# EAGLE design esp8266_programmer (EAGLE 9.6.2)
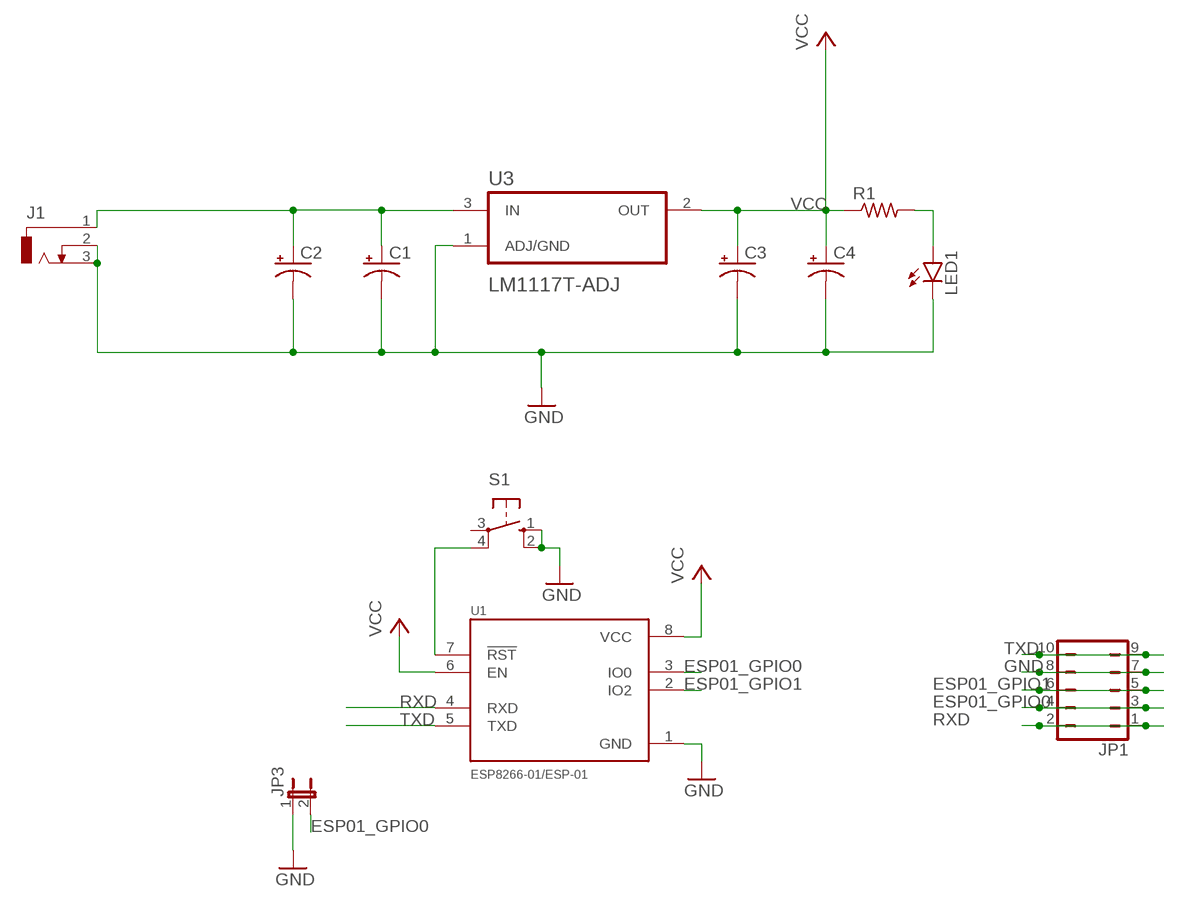
[diagram p0: schematic, sheet 1]

## Parts
C1  CPOL-USE1.8-4  [E1,8-4]
C2  CPOL-USE1.8-4  [E1,8-4]
C3  CPOL-USE1.8-4  [E1,8-4]
C4  CPOL-USE1.8-4  [E1,8-4]
J1  DCJ0303  [DCJ0303]
JP1  JP5Q  [JP5Q]
JP3  JP1E  [JP1]
LED1  LED3MM  [LED3MM]
R1  R-US_0204/7  [0204/7]
S1  10-XX  [B3F-10XX]
U1  ESP8266-01/ESP-01  [XCVR_ESP8266-01/ESP-01]
U3  LM1117T-ADJ  [TO254P1054X470X1955-3]

## Nets
ESP01_GPIO0: JP1.3 JP1.4 JP3.2 U1.3(IO0)
ESP01_GPIO1: JP1.5 JP1.6 U1.2(IO2)
GND: C1.- C2.- C3.- C4.- J1.2 J1.3 JP1.7 JP1.8 JP3.1 LED1.K(C) S1.1(S) S1.2(S1) U1.1(GND) U3.1(ADJ/GND)
N$1: C1.+ C2.+ J1.1 U3.3(IN)
N$3: S1.4(P1) U1.7(!RST)
N$9: LED1.A R1.2
RXD: JP1.1 JP1.2 U1.4(RXD)
TXD: JP1.9 JP1.10 U1.5(TXD)
VCC: C3.+ C4.+ R1.1 U1.6(EN) U1.8(VCC) U3.2(OUT)
Unconnected: S1.3(P)

## Library data of the parts
C1-C4 = rcl:CPOL-US: POLARIZED CAPACITOR, American symbol; SPICEPREFIX: C
J1 = con-jack:DCJ0303: DC POWER JACK Source: DCJ0303.pdf; OC_FARNELL: unknown; OC_NEWARK: unknown
JP1 = jumper:JP5Q: JUMPER
JP3 = jumper:JP1E: JUMPER
LED1 = led:LED: LED OSRAM: - CHIPLED LG R971, LG N971, LY N971, LG Q971, LY Q971, LO R971, LY R971 LH N974, LH R974 LS Q976, LO Q976, LY Q976 LO Q996 - Hyper CHIPLED LW Q18S LB Q993, LB Q99A, LB R99A - SideLED LS A670, LO A670, LY A670, LG A670, LP A670 LB A673, LV A673, LT A673, LW A673 LH A674 LY A675 LS A676, LA A676, LO A676, LY A676, LW A676 LS A679, LY A679, LG A679 - Hyper Micro SIDELED® LS Y876, LA Y876, LO Y876, LY Y876 LT Y87S - SmartLED LW L88C, LW L88S LB L89C, LB L89S, LG L890 LS L89K, LO L89K, LY L89K LS L896, LA L896, LO L896, LY L896 - TOPLED LS T670, LO T670, LY T670, LG T670, LP T670 LSG T670, LSP T670, LSY T670, LOP T670, LYG T670 LG T671, LOG T671, LSG T671 LB T673, LV T673, LT T673, LW T673 LH T674 LS T676, LA T676, LO T676, LY T676, LB T676, LH T676, LSB T676, LW T676 LB T67C, LV T67C, LT T67C, LS T67K, LO T67K, LY T67K, LW E67C LS E67B, LA E67B, LO E67B, LY E67B, LB E67C, LV E67C, LT E67C LW T67C LS T679, LY T679, LG T679 LS T770, LO T770, LY T770, LG T770, LP T770 LB T773, LV T773, LT T773, LW T773 LH T774 LS E675, LA E675, LY E675, LS T675 LS T776, LA T776, LO T776, LY T776, LB T776 LHGB T686 LT T68C, LB T68C - Hyper Mini TOPLED® LB M676 - Mini TOPLED Santana® LG M470 LS M47K, LO M47K, LY M47K Source: http://www.osram.convergy.de LUXEON: - LUMILED® LXK2-PW12-R00, LXK2-PW12-S00, LXK2-PW14-U00, LXK2-PW14-V00 LXK2-PM12-R00, LXK2-PM12-S00, LXK2-PM14-U00 LXK2-PE12-Q00, LXK2-PE12-R00, LXK2-PE12-S00, LXK2-PE14-T00, LXK2-PE14-U00 LXK2-PB12-K00, LXK2-PB12-L00, LXK2-PB12-M00, LXK2-PB14-N00, LXK2-PB14-P00, LXK2-PB14-Q00 LXK2-PR12-L00, LXK2-PR12-M00, LXK2-PR14-Q00, LXK2-PR14-R00 LXK2-PD12-Q00, LXK2-PD12-R00, LXK2-PD12-S00 LXK2-PH12-R00, LXK2-PH12-S00 LXK2-PL12-P00, LXK2-PL12-Q00, LXK2-PL12-R00 Source: www.luxeon.com KINGBRIGHT: KA-3528ASYC Source: www.kingbright.com
R1 = rcl:R-US_: RESISTOR, American symbol; SPICEPREFIX: R
S1 = switch-omron:10-XX: OMRON SWITCH; MPN: B3F-1000; OC_FARNELL: 176432; OC_NEWARK: 36M3542
U1 = ESP8266-01_ESP-01:ESP8266-01/ESP-01: MakerFocus 4pcs ESP8266 ESP-01 Serial Wireless WiFi Transceiver Receiver Module 1MB SPI Flash DC3.0-3.6V Internet of Things WiFi Module Board Compatible with Ar duino Check availability <https://pricing.snapeda.com/parts/ESP8266-01/ESP-01/AI-Thinker/view-part?ref=eda>; AVAILABILITY: Not in stock; CHECK_PRICES: https://www.snapeda.com/parts/ESP8266-01/ESP-01/AI-Thinker/view-part/?ref=eda; DESCRIPTION: MakerFocus 4pcs ESP8266 ESP-01 Serial Wireless WiFi Transceiver Receiver Module 1MB SPI Flash DC3.0-3.6V Internet of Things WiFi Module Board Compatible with Ar duino; MF: AI-Thinker; MP: ESP8266-01/ESP-01; PACKAGE: Non-Standard AI-Thinker; PRICE: None; SNAPEDA_LINK: https://www.snapeda.com/parts/ESP8266-01/ESP-01/AI-Thinker/view-part/?ref=snap
U3 = LM1117T-ADJ:LM1117T-ADJ: Check availability <https://pricing.snapeda.com/parts/LM1117T-ADJ/Texas%20Instruments/view-part?ref=eda>; AVAILABILITY: In Stock; CHECK_PRICES: https://www.snapeda.com/parts/LM1117T-ADJ/Texas+Instruments/view-part/?ref=eda; DESCRIPTION: Linear Voltage Regulator IC Positive Adjustable 1 Output 800mA TO-220-3; MF: Texas Instruments; MP: LM1117T-ADJ; PACKAGE: TO-220-3 TEXAS INSTRUMENTS; PRICE: None; PURCHASE-URL: https://www.snapeda.com/api/url_track_click_mouser/?unipart_id=558049&manufacturer=Texas Instruments&part_name=LM1117T-ADJ&search_term=None; SNAPEDA_LINK: https://www.snapeda.com/parts/LM1117T-ADJ/Texas+Instruments/view-part/?ref=snap

## Board
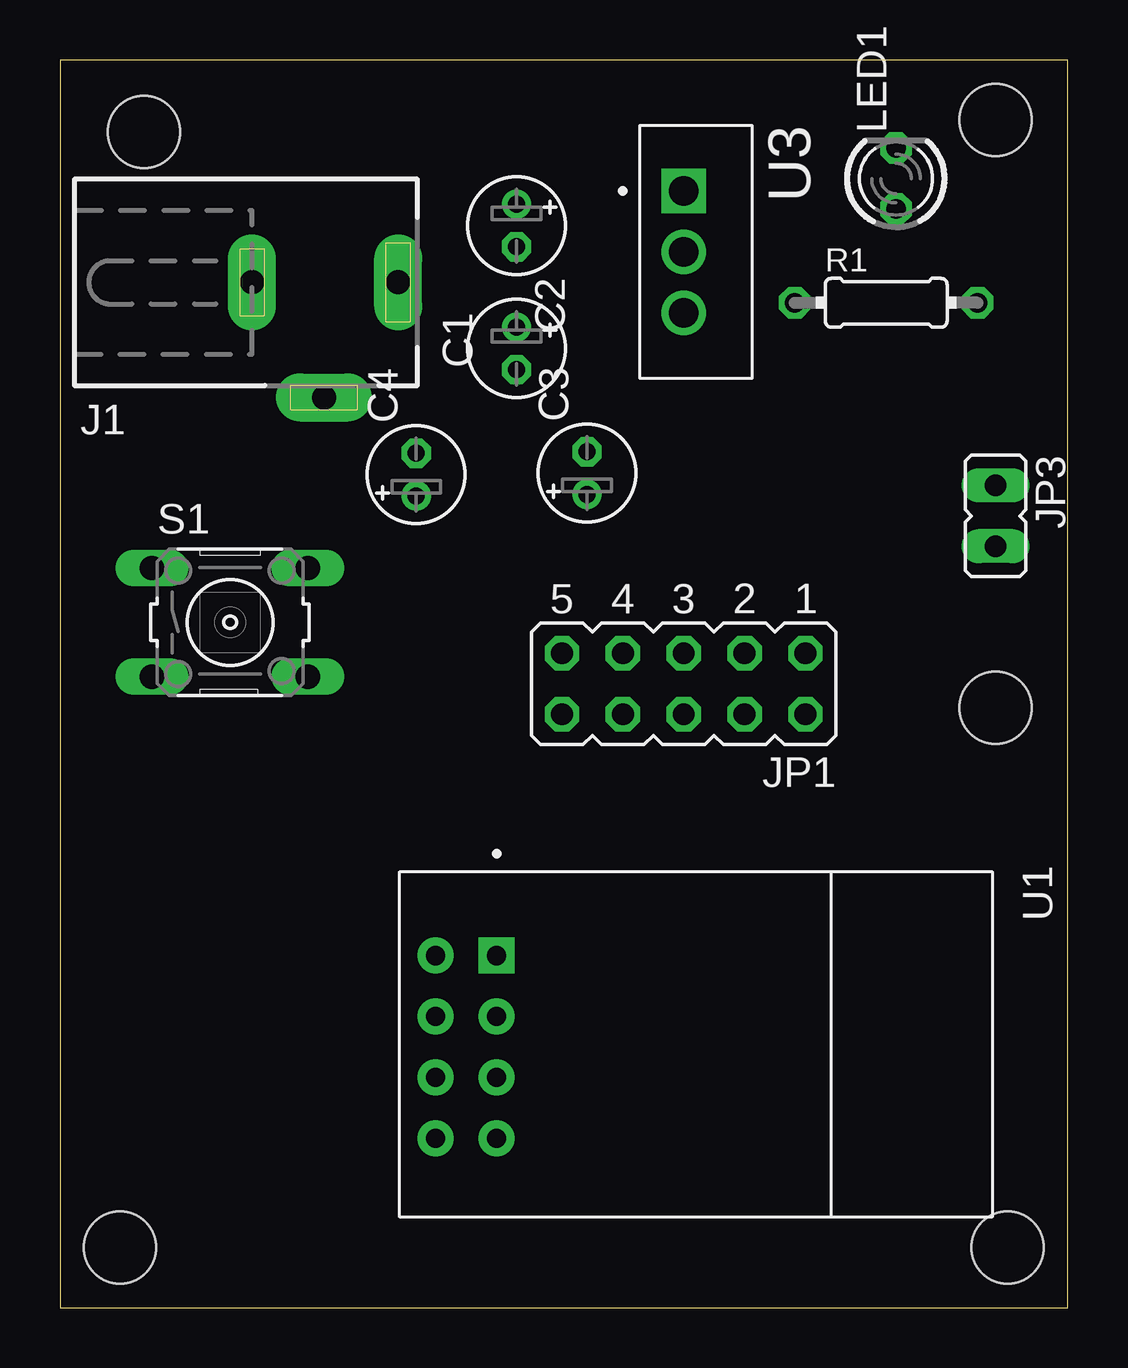
[diagram p1: board, top side]
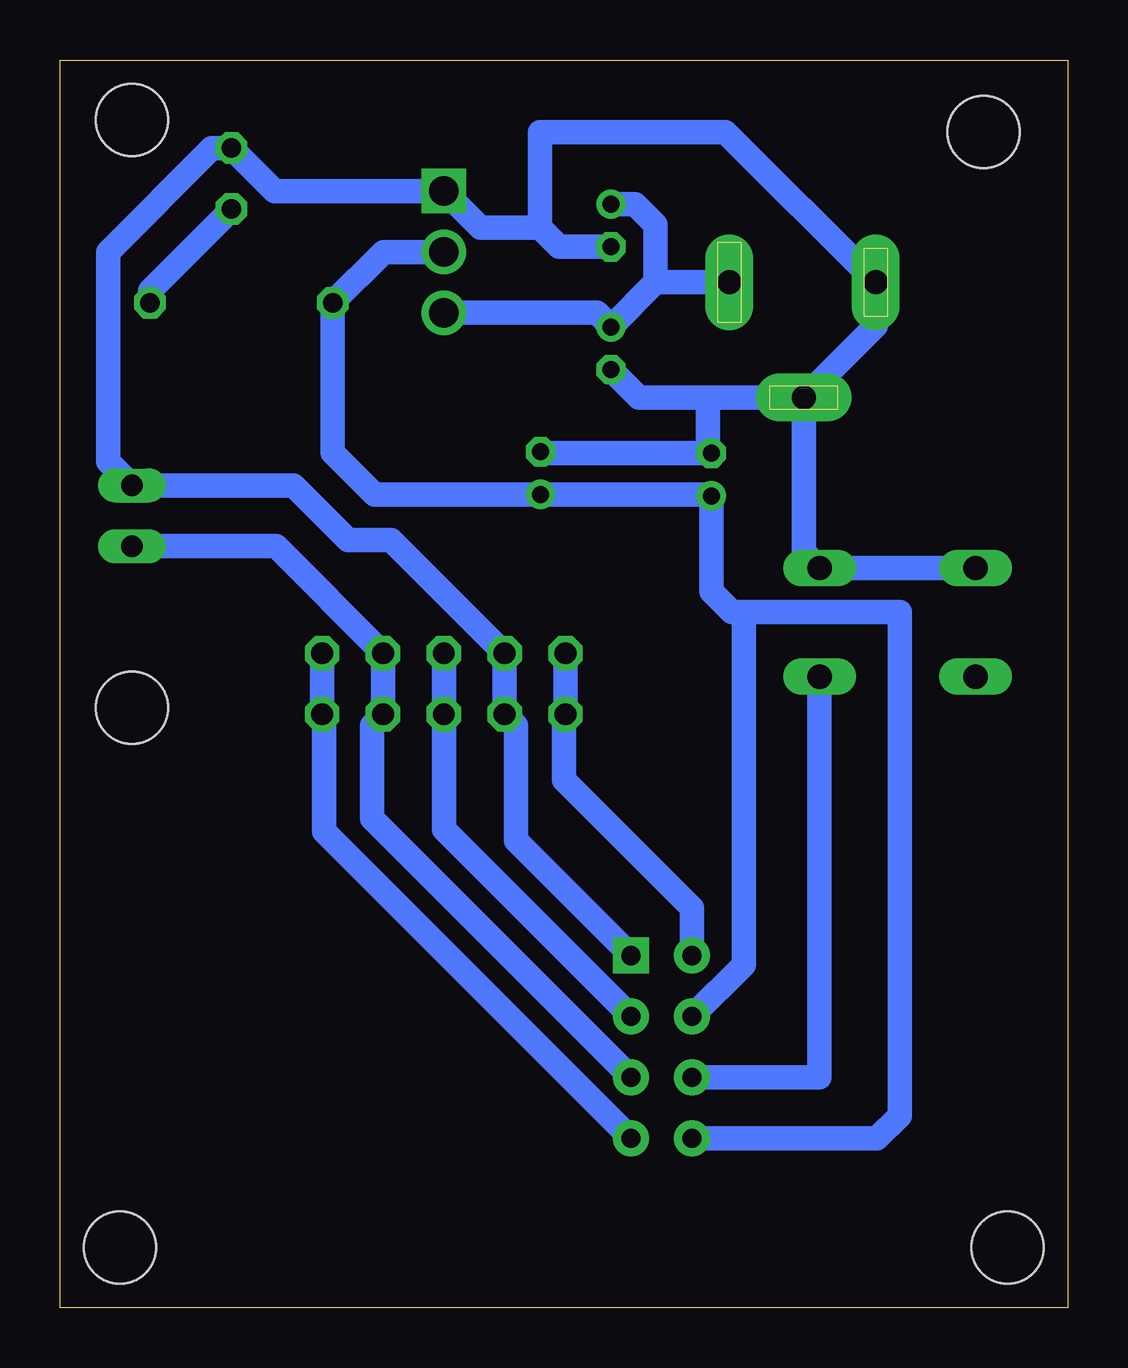
[diagram p2: board, bottom side, seen from below]

Size 42 x 52 mm. Coordinates in mm from the lower left corner, seen from the top.
Outline: 0,0 42,0 42,52 0,52 0,0
Copper layers (1*16): Top 0.035mm / dielectric 1.5mm / Bottom 0.035mm
Design rules "default *": minimum track width 25mil, minimum drill 1mm, track to track 6mil, track to pad 6mil, pad to pad 6mil, via to via 6mil, smd to smd 6mil, copper to edge 40mil, drill to drill 6mil, minimum pad ring 10mil, minimum via ring 8mil, stop-mask expansion 4mil, vias tented up to drill 0mil, thermal gap 10mil
Holes 3 mm at 3.5,49 39,49.5 2.5,2.5 39,25 39.5,2.5

### Footprints (pad centres in the part's own frame; a part is rotated, then mirrored left to right if it is on the bottom)
E1,8-4 = drill 0.711 pad 1.168: + -0.889,0 | drill 0.711 pad 1.168 octagon: - 0.889,0
DCJ0303 = drill 1 pad 2 long: 1 0,3.1; 2 4.8,0; 3 0,-3
JP5Q = drill 0.914 octagon: 1 -5.08,-1.27; 2 -5.08,1.27; 3 -2.54,-1.27; 4 -2.54,1.27; 5 0,-1.27; 6 0,1.27; 7 2.54,-1.27; 8 2.54,1.27; 9 5.08,-1.27; 10 5.08,1.27
JP1 = drill 0.914 long: 1 0,-1.27; 2 0,1.27
LED3MM = drill 0.813 octagon: A -1.27,0; K 1.27,0
0204/7 = drill 0.813 octagon: 1 -3.81,0; 2 3.81,0
B3F-10XX = drill 1.016 long: 1 -3.251,2.261; 2 3.251,2.261; 3 -3.251,-2.261; 4 3.251,-2.261
XCVR_ESP8266-01/ESP-01 = drill 0.8 pad 1.5 square: 1 -3.81,-8.31 | drill 0.8 pad 1.5: 2 -1.27,-8.31; 3 1.27,-8.31; 4 3.81,-8.31; 5 -3.81,-10.85; 6 -1.27,-10.85; 7 1.27,-10.85; 8 3.81,-10.85
TO254P1054X470X1955-3 = drill 1.24 square: 1 -2.54,0 | drill 1.24: 2 0,0; 3 2.54,0

### Placement (x,y rotation side)
C1  19.03,39.98 270 top
C2  19.03,45.1 270 top
C3  21.97,34.78 90 top
C4  14.85,34.72 90 top
J1  11,42.73 270 top
JP1  26,26 180 top
JP3  39,33 180 top
LED1  34.85,47.06 90 top
R1  34.44,41.88 0 top
S1  7.09,28.56 0 top
U1  26.51,10.86 270 top
U3  26,44 270 top

### Tracks (layer width: path | path; a pad name or v marks a point on that pad's centre or on a via)
ESP01_GPIO0
  Bottom 1.016: U1.3 29,20.39 29,24.27 JP1.4 JP1.3 33,31.73 JP3.2
ESP01_GPIO1
  Bottom 1.016: U1.2 26,19.93 JP1.6 JP1.5
GND
  Bottom 1.016: U1.1 23,19.47 23,24.27 JP1.8 JP1.7 28.19,32 30,32 32.27,34.27 JP3.1 40,35.27 40,44 35.67,48.33 LED1.K 33.06,46.54 U3.1 24.48,45.02 22,45.02 | J1.2 8,40.93 J1.3 14.27,49 22,49 22,45.02 | J1.2 11,31.48 10.52,31 | 10.52,31 S1.2 | S1.1 S1.2 | S1.2 10.52,31 | C1.- 17.87,37.93 15,37.93 | J1.2 15,37.93 | C3.- 21.91,35.61 C4.- 15,35.76 15,37.93 | C2.- 21.19,44.21 22,45.02
N$1
  Bottom 1.016: J1.1 17.17,42.73 | 17.17,42.73 C1.+ 19.62,41.46 U3.3 | C2.+ 18.03,45.99 17.17,45.13 17.17,42.73
N$3
  Bottom 1.016: U1.7 10.34,9.59 S1.4
N$9
  Bottom 1.016: LED1.A 38.25,42.39 R1.2
RXD
  Bottom 1.016: U1.4 31,19.85 31,24.65 JP1.2 JP1.1
TXD
  Bottom 1.016: U1.5 15.66,16.66 21,22 21,24.65 JP1.10 JP1.9
VCC
  Bottom 1.016: 13.5,29 14,29 14.85,29.85 C4.+ 14.91,33.89 C3.+ 28.89,33.89 30.63,35.63 R1.1 28.51,44 U3.2 | 13.5,29 7,29 7,8 7.95,7.05 U1.8 | U1.6 13.5,14.29 13.5,29